# EAGLE design LPC1768 (EAGLE 7.5.0)

## Sheet 1 of 4
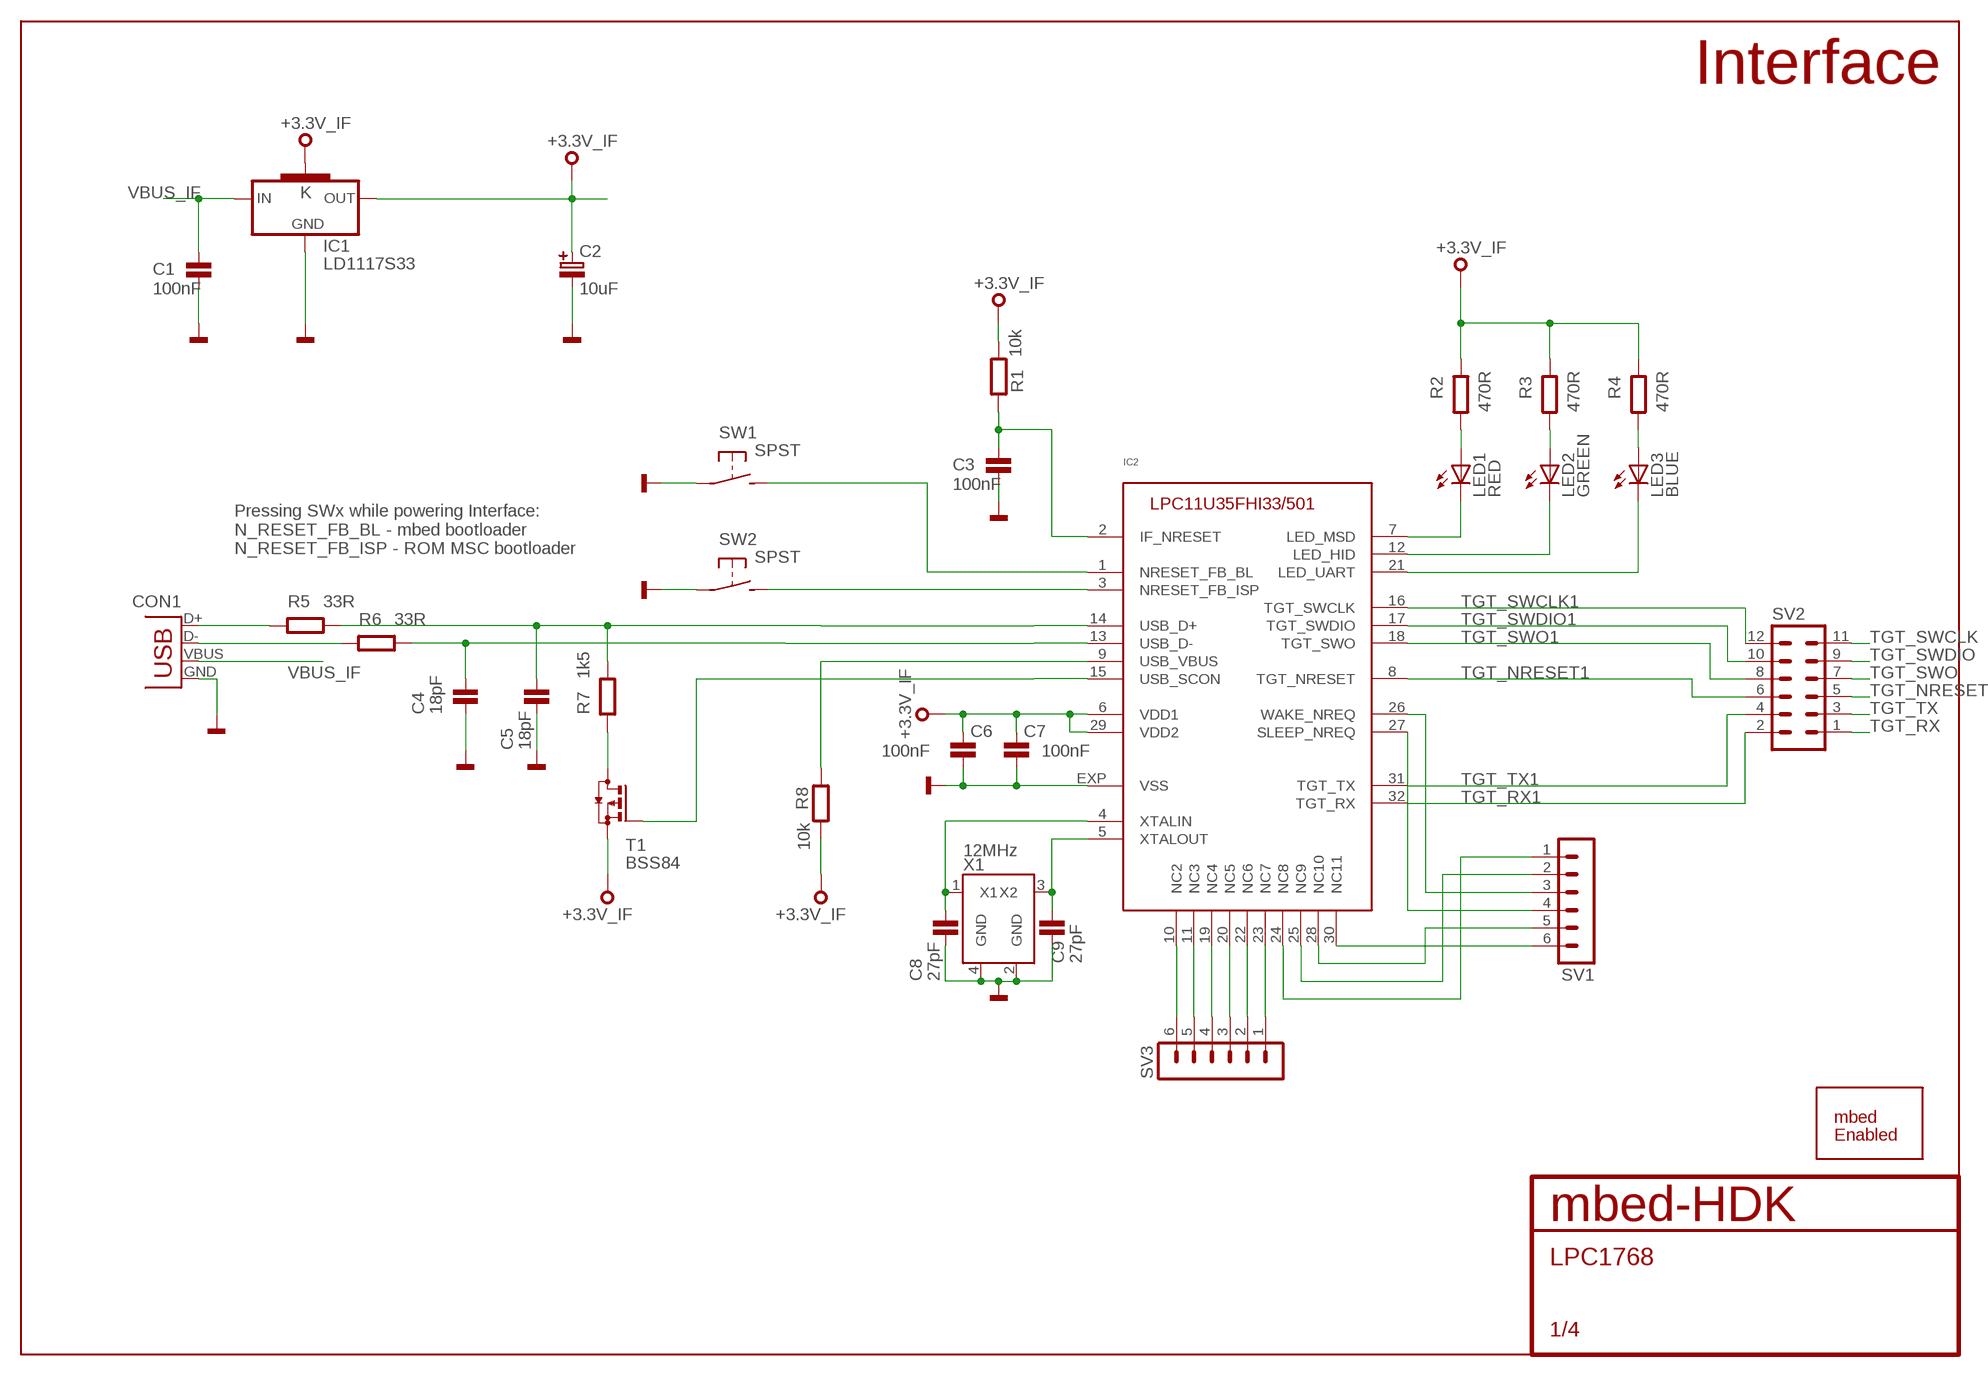
[diagram p0: schematic, sheet 1]

### Parts
C1  100nF  C0603  [0603]
C2  10uF  C-POLB  [CASE-B]
C3  100nF  C0603  [0603]
C4  18pF  C0603  [0603]
C5  18pF  C0603  [0603]
C6  100nF  C0603  [0603]
C7  100nF  C0603  [0603]
C8  27pF  C0603  [0603]
C9  27pF  C0603  [0603]
CON1  USB-MB-S  [USB-MB-S]
IC1  LD1117S33  [SOT223]
IC2  IF-LPC11U35  [HVQFN33]
LED1  RED  LED0603  [CHIPLED_0603]
LED2  GREEN  LED0603  [CHIPLED_0603]
LED3  BLUE  LED0603  [CHIPLED_0603]
R1  10k  R0603  [0603]
R2  470R  R0603  [0603]
R3  470R  R0603  [0603]
R4  470R  R0603  [0603]
R5  33R  R0603  [0603]
R6  33R  R0603  [0603]
R7  1k5  R0603  [0603]
R8  10k  R0603  [0603]
SS1  MBED-ENABLED-LOGOMEDIUM  [MBED-ENABLED-LOGO-500X500-MIL]
SV1  MA06-1  [MA06-1]
SV2  MA06-2  [MA06-2]
SV3  MA06-1  [MA06-1]
SW1  SPST  [DTSM-32S-B]
SW2  SPST  [DTSM-32S-B]
T1  BSS84  [SOT23]
X1  12MHz  ABM8  [OSC_CMD_32_25]

### Nets
+3.3V_IF: C2.1 C6.1 C7.1 IC1.2(OUT) IC1.4(K) IC2.6(VDD1) IC2.29(VDD2) R1.2 R2.1 R3.1 R4.1 R8.2 T1.2(S)
GND: C1.2 C2.2 C3.2 C4.2 C5.2 C6.2 C7.2 C8.2 C9.2 CON1.GND IC1.1(GND) IC2.EXP(VSS) SW1.P$1(P) SW2.P$1(P) X1.2(GND) X1.4(GND) ; also sheet 2,3
GREEN: IC2.12(LED_HID) LED2.C
GREEN1: IC2.7(LED_MSD) LED1.C
N$1: C5.1 IC2.14(USB_D+) R5.2 R7.2
N$2: C4.1 IC2.13(USB_D-) R6.2
N$3: CON1.D- R6.1
N$4: CON1.D+ R5.1
N$5: C3.1 IC2.2(IF_NRESET) R1.1
N$6: R7.1 T1.3(D)
N$7: IC2.9(USB_VBUS) R8.1
N$8: LED1.A R2.2
N$9: LED2.A R3.2
N$11: C8.1 IC2.4(XTALIN) X1.1(X1)
N$12: C9.1 IC2.5(XTALOUT) X1.3(X2)
N$13: IC2.21(LED_UART) LED3.C
N$15: IC2.1(NRESET_FB_BL) SW1.P$2(S)
N$17: IC2.3(NRESET_FB_ISP) SW2.P$2(S)
N$18: LED3.A R4.2
N$19: IC2.15(USB_SCON) T1.1(G)
N$79: IC2.30(NC11) SV1.6
N$80: IC2.28(NC10) SV1.5
N$81: IC2.27(SLEEP_NREQ) SV1.4
N$82: IC2.26(WAKE_NREQ) SV1.3
N$83: IC2.25(NC9) SV1.2
N$84: IC2.24(NC8) SV1.1
N$85: IC2.10(NC2) SV3.6
N$86: IC2.11(NC3) SV3.5
N$87: IC2.19(NC4) SV3.4
N$88: IC2.20(NC5) SV3.3
N$89: IC2.22(NC6) SV3.2
N$90: IC2.23(NC7) SV3.1
TGT_NRESET: SV2.5 ; also sheet 2
TGT_NRESET1: IC2.8(TGT_NRESET) SV2.6
TGT_RX: SV2.1 ; also sheet 2
TGT_RX1: IC2.32(TGT_RX) SV2.2
TGT_SWCLK: SV2.11 ; also sheet 2
TGT_SWCLK1: IC2.16(TGT_SWCLK) SV2.12
TGT_SWDIO: SV2.9 ; also sheet 2
TGT_SWDIO1: IC2.17(TGT_SWDIO) SV2.10
TGT_SWO: SV2.7 ; also sheet 2
TGT_SWO1: IC2.18(TGT_SWO) SV2.8
TGT_TX: SV2.3 ; also sheet 2
TGT_TX1: IC2.31(TGT_TX) SV2.4
VBUS_IF: C1.1 CON1.VBUS IC1.3(IN) ; also sheet 3

### Notes on the sheet
- Interface
- Pressing SWx while powering Interface:
  N_RESET_FB_BL - mbed bootloader
  N_RESET_FB_ISP - ROM MSC bootloader

## Sheet 2 of 4
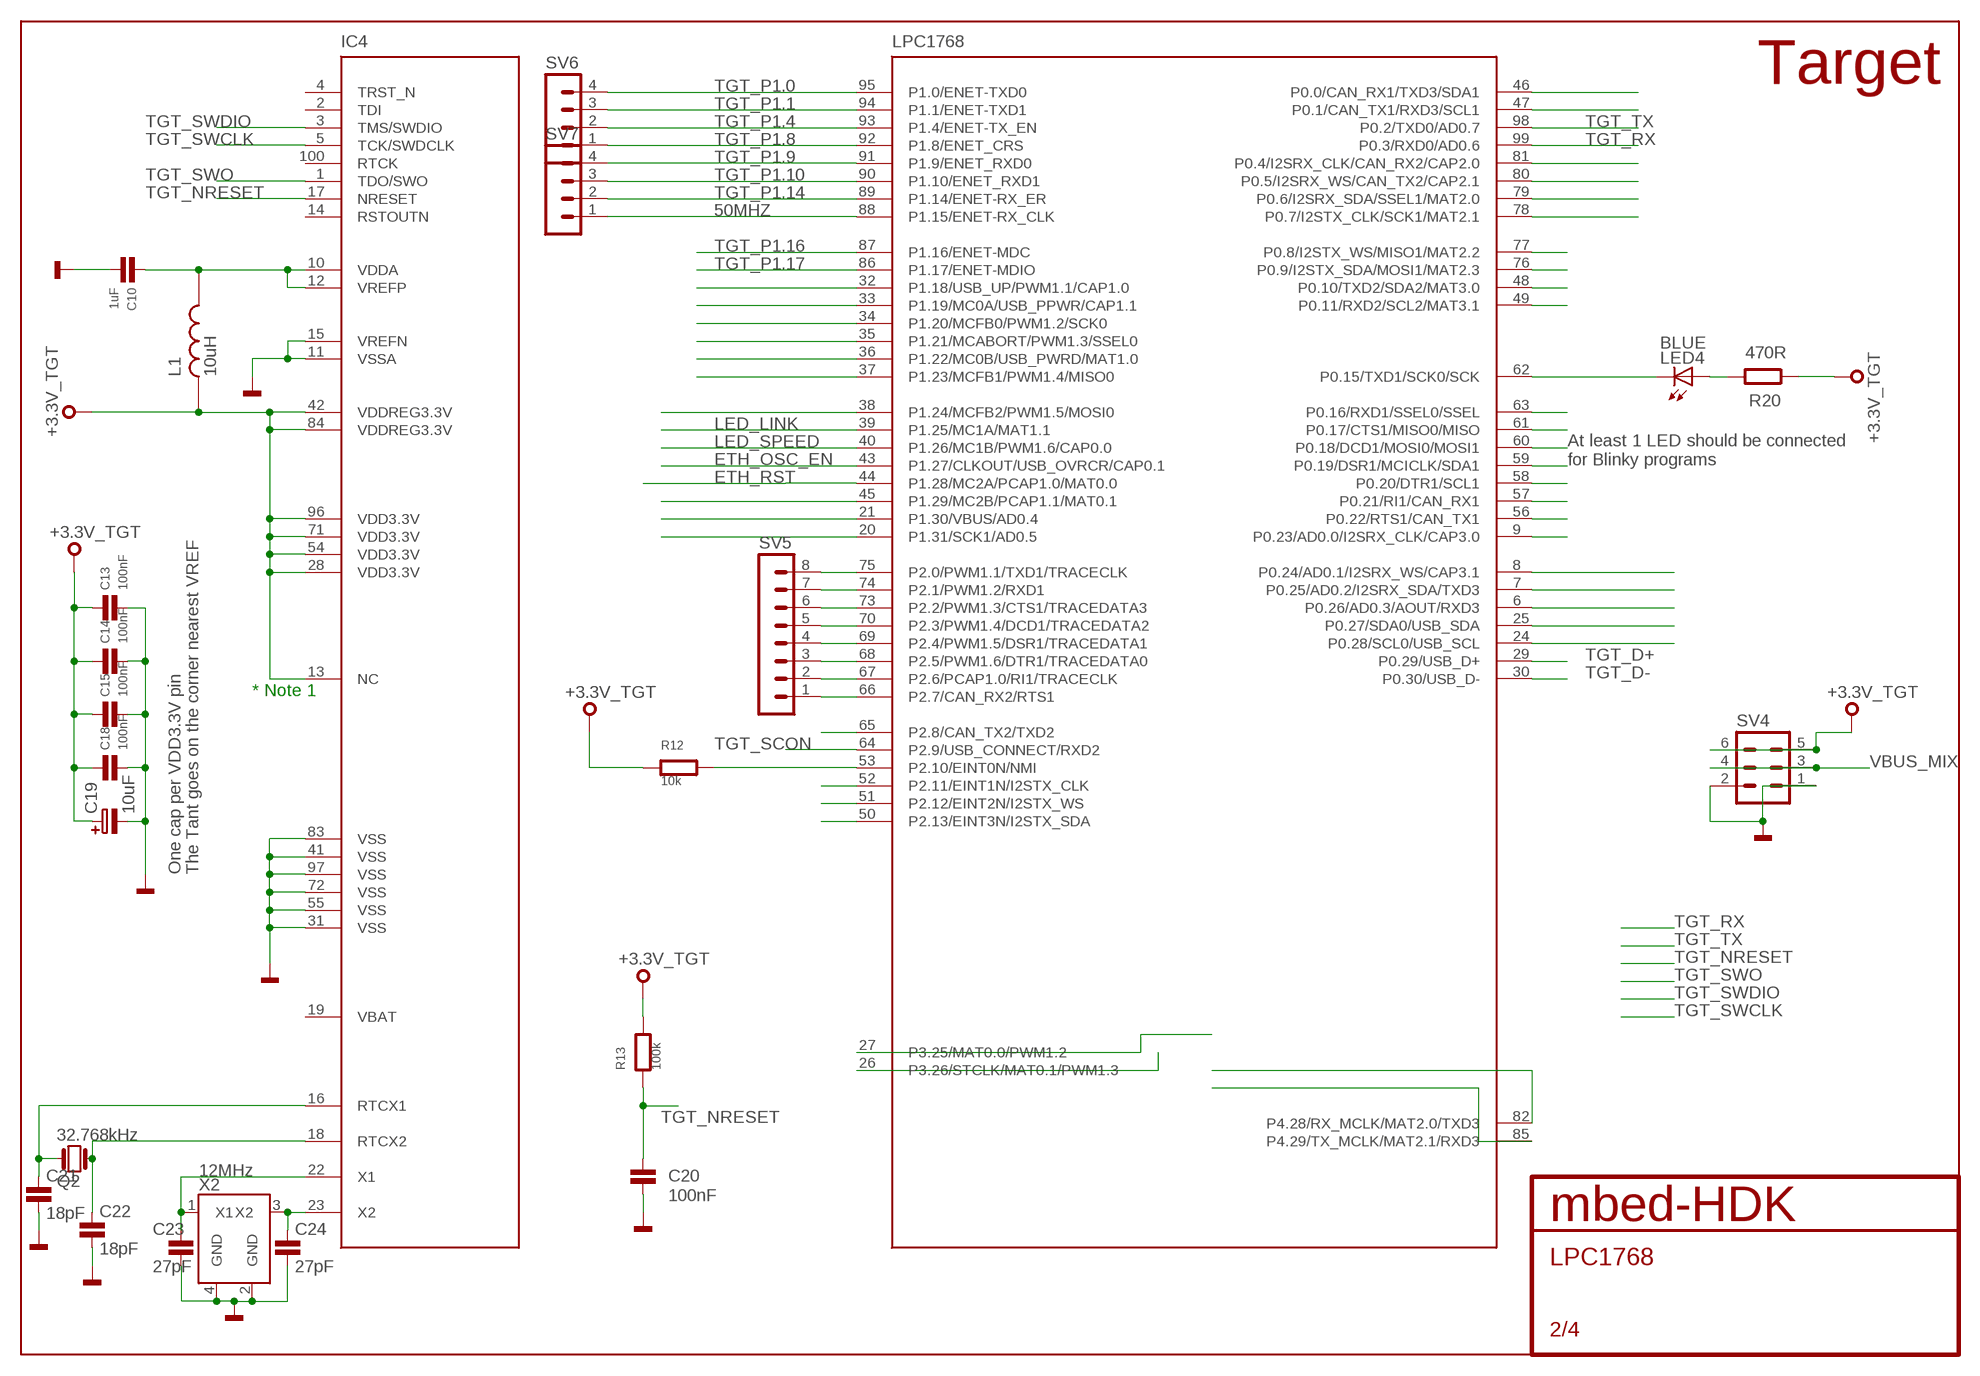
[diagram p1: schematic, sheet 2]

### Parts
C10  1uF  C0603  [0603]
C13  100nF  C0603  [0603]
C14  100nF  C0603  [0603]
C15  100nF  C0603  [0603]
C18  100nF  C0603  [0603]
C19  10uF  C-POLB  [CASE-B]
C20  100nF  C0603  [0603]
C21  18pF  C0603  [0603]
C22  18pF  C0603  [0603]
C23  27pF  C0603  [0603]
C24  27pF  C0603  [0603]
IC4  LPC1768  [LQFP100]
L1  10uH  L  [0603]
LED4  BLUE  LED0603  [CHIPLED_0603]
Q2  32.768kHz  Q_FC135  [FC135]
R12  10k  R0603  [0603]
R13  100k  R0603  [0603]
R20  470R  R0603  [0603]
SV4  MA03-2  [MA03-2]
SV5  MA08-1  [MA08-1]
SV6  MA04-1  [MA04-1]
SV7  MA04-1  [MA04-1]
X2  12MHz  ABM8  [OSC_CMD_32_25]

### Nets
50MHZ: IC4.88(P1.15/ENET-RX_CLK) SV7.1
+3.3V_TGT: C13.1 C14.1 C15.1 C18.1 C19.1 IC4.13(NC) IC4.28(VDD3.3V) IC4.42(VDDREG3.3V) IC4.54(VDD3.3V) IC4.71(VDD3.3V) IC4.84(VDDREG3.3V) IC4.96(VDD3.3V) L1.1 R12.1 R13.2 R20.1 SV4.5 SV4.6 ; also sheet 3
ETH_OSC_EN: IC4.43(P1.27/CLKOUT/USB_OVRCR/CAP0.1)
ETH_RST: IC4.44(P1.28/MC2A/PCAP1.0/MAT0.0)
GND: C10.2 C13.2 C14.2 C15.2 C18.2 C19.2 C20.1 C21.1 C22.1 C23.1 C24.1 IC4.11(VSSA) IC4.15(VREFN) IC4.31(VSS) IC4.41(VSS) IC4.55(VSS) IC4.72(VSS) IC4.83(VSS) IC4.97(VSS) SV4.1 SV4.2 X2.2(GND) X2.4(GND) ; also sheet 1,3
LED_LINK: IC4.39(P1.25/MC1A/MAT1.1)
LED_SPEED: IC4.40(P1.26/MC1B/PWM1.6/CAP0.0)
N$16: C10.1 IC4.10(VDDA) IC4.12(VREFP) L1.2
N$20: IC4.53(P2.10/EINT0N/NMI) R12.2
N$21: C23.2 IC4.22(X1) X2.1(X1)
N$23: C21.2 IC4.16(RTCX1) Q2.X2
N$24: C22.2 IC4.18(RTCX2) Q2.X1
N$25: IC4.62(P0.15/TXD1/SCK0/SCK) LED4.C
N$26: LED4.A R20.2
N$27: IC4.32(P1.18/USB_UP/PWM1.1/CAP1.0)
N$30: IC4.33(P1.19/MC0A/USB_PPWR/CAP1.1)
N$31: IC4.34(P1.20/MCFB0/PWM1.2/SCK0)
N$32: IC4.35(P1.21/MCABORT/PWM1.3/SSEL0)
N$33: IC4.36(P1.22/MC0B/USB_PWRD/MAT1.0)
N$34: IC4.37(P1.23/MCFB1/PWM1.4/MISO0)
N$35: IC4.38(P1.24/MCFB2/PWM1.5/MOSI0)
N$36: IC4.45(P1.29/MC2B/PCAP1.1/MAT0.1)
N$37: IC4.21(P1.30/VBUS/AD0.4)
N$38: IC4.20(P1.31/SCK1/AD0.5)
N$39: IC4.75(P2.0/PWM1.1/TXD1/TRACECLK) SV5.8
N$40: IC4.74(P2.1/PWM1.2/RXD1) SV5.7
N$41: IC4.73(P2.2/PWM1.3/CTS1/TRACEDATA3) SV5.6
N$42: IC4.70(P2.3/PWM1.4/DCD1/TRACEDATA2) SV5.5
N$43: IC4.69(P2.4/PWM1.5/DSR1/TRACEDATA1) SV5.4
N$44: IC4.68(P2.5/PWM1.6/DTR1/TRACEDATA0) SV5.3
N$45: IC4.67(P2.6/PCAP1.0/RI1/TRACECLK) SV5.2
N$46: IC4.66(P2.7/CAN_RX2/RTS1) SV5.1
N$47: IC4.65(P2.8/CAN_TX2/TXD2)
N$48: IC4.52(P2.11/EINT1N/I2STX_CLK)
N$49: IC4.51(P2.12/EINT2N/I2STX_WS)
N$50: IC4.50(P2.13/EINT3N/I2STX_SDA)
N$51: IC4.27(P3.25/MAT0.0/PWM1.2)
N$52: IC4.26(P3.26/STCLK/MAT0.1/PWM1.3)
N$53: IC4.82(P4.28/RX_MCLK/MAT2.0/TXD3)
N$54: IC4.85(P4.29/TX_MCLK/MAT2.1/RXD3)
N$55: IC4.24(P0.28/SCL0/USB_SCL)
N$56: IC4.25(P0.27/SDA0/USB_SDA)
N$57: IC4.6(P0.26/AD0.3/AOUT/RXD3)
N$58: IC4.7(P0.25/AD0.2/I2SRX_SDA/TXD3)
N$59: IC4.8(P0.24/AD0.1/I2SRX_WS/CAP3.1)
N$60: IC4.9(P0.23/AD0.0/I2SRX_CLK/CAP3.0)
N$61: IC4.56(P0.22/RTS1/CAN_TX1)
N$62: IC4.57(P0.21/RI1/CAN_RX1)
N$63: IC4.58(P0.20/DTR1/SCL1)
N$64: IC4.59(P0.19/DSR1/MCICLK/SDA1)
N$65: IC4.60(P0.18/DCD1/MOSI0/MOSI1)
N$66: IC4.61(P0.17/CTS1/MISO0/MISO)
N$67: IC4.63(P0.16/RXD1/SSEL0/SSEL)
N$68: IC4.49(P0.11/RXD2/SCL2/MAT3.1)
N$69: IC4.48(P0.10/TXD2/SDA2/MAT3.0)
N$70: IC4.76(P0.9/I2STX_SDA/MOSI1/MAT2.3)
N$71: IC4.77(P0.8/I2STX_WS/MISO1/MAT2.2)
N$72: IC4.78(P0.7/I2STX_CLK/SCK1/MAT2.1)
N$73: IC4.79(P0.6/I2SRX_SDA/SSEL1/MAT2.0)
N$74: IC4.80(P0.5/I2SRX_WS/CAN_TX2/CAP2.1)
N$75: IC4.81(P0.4/I2SRX_CLK/CAN_RX2/CAP2.0)
N$76: IC4.47(P0.1/CAN_TX1/RXD3/SCL1)
N$77: IC4.46(P0.0/CAN_RX1/TXD3/SDA1)
N$78: C24.2 IC4.23(X2) X2.3(X2)
TGT_D+: IC4.29(P0.29/USB_D+) ; also sheet 3
TGT_D-: IC4.30(P0.30/USB_D-) ; also sheet 3
TGT_NRESET: C20.2 IC4.17(NRESET) R13.1 ; also sheet 1
TGT_P1.0: IC4.95(P1.0/ENET-TXD0) SV6.4
TGT_P1.1: IC4.94(P1.1/ENET-TXD1) SV6.3
TGT_P1.4: IC4.93(P1.4/ENET-TX_EN) SV6.2
TGT_P1.8: IC4.92(P1.8/ENET_CRS) SV6.1
TGT_P1.9: IC4.91(P1.9/ENET_RXD0) SV7.4
TGT_P1.10: IC4.90(P1.10/ENET_RXD1) SV7.3
TGT_P1.14: IC4.89(P1.14/ENET-RX_ER) SV7.2
TGT_P1.16: IC4.87(P1.16/ENET-MDC)
TGT_P1.17: IC4.86(P1.17/ENET-MDIO)
TGT_RX: IC4.99(P0.3/RXD0/AD0.6) ; also sheet 1
TGT_SCON: IC4.64(P2.9/USB_CONNECT/RXD2) ; also sheet 3
TGT_SWCLK: IC4.5(TCK/SWDCLK) ; also sheet 1
TGT_SWDIO: IC4.3(TMS/SWDIO) ; also sheet 1
TGT_SWO: IC4.1(TDO/SWO) ; also sheet 1
TGT_TX: IC4.98(P0.2/TXD0/AD0.7) ; also sheet 1
VBUS_MIX: SV4.3 SV4.4 ; also sheet 3
Unconnected: IC4.2(TDI) IC4.4(TRST_N) IC4.14(RSTOUTN) IC4.19(VBAT) IC4.100(RTCK)

### Notes on the sheet
- Target
- At least 1 LED should be connected
  for Blinky programs
- * Note 1
- One cap per VDD3.3V pin | The Tant goes on the corner nearest VREF

## Sheet 3 of 4
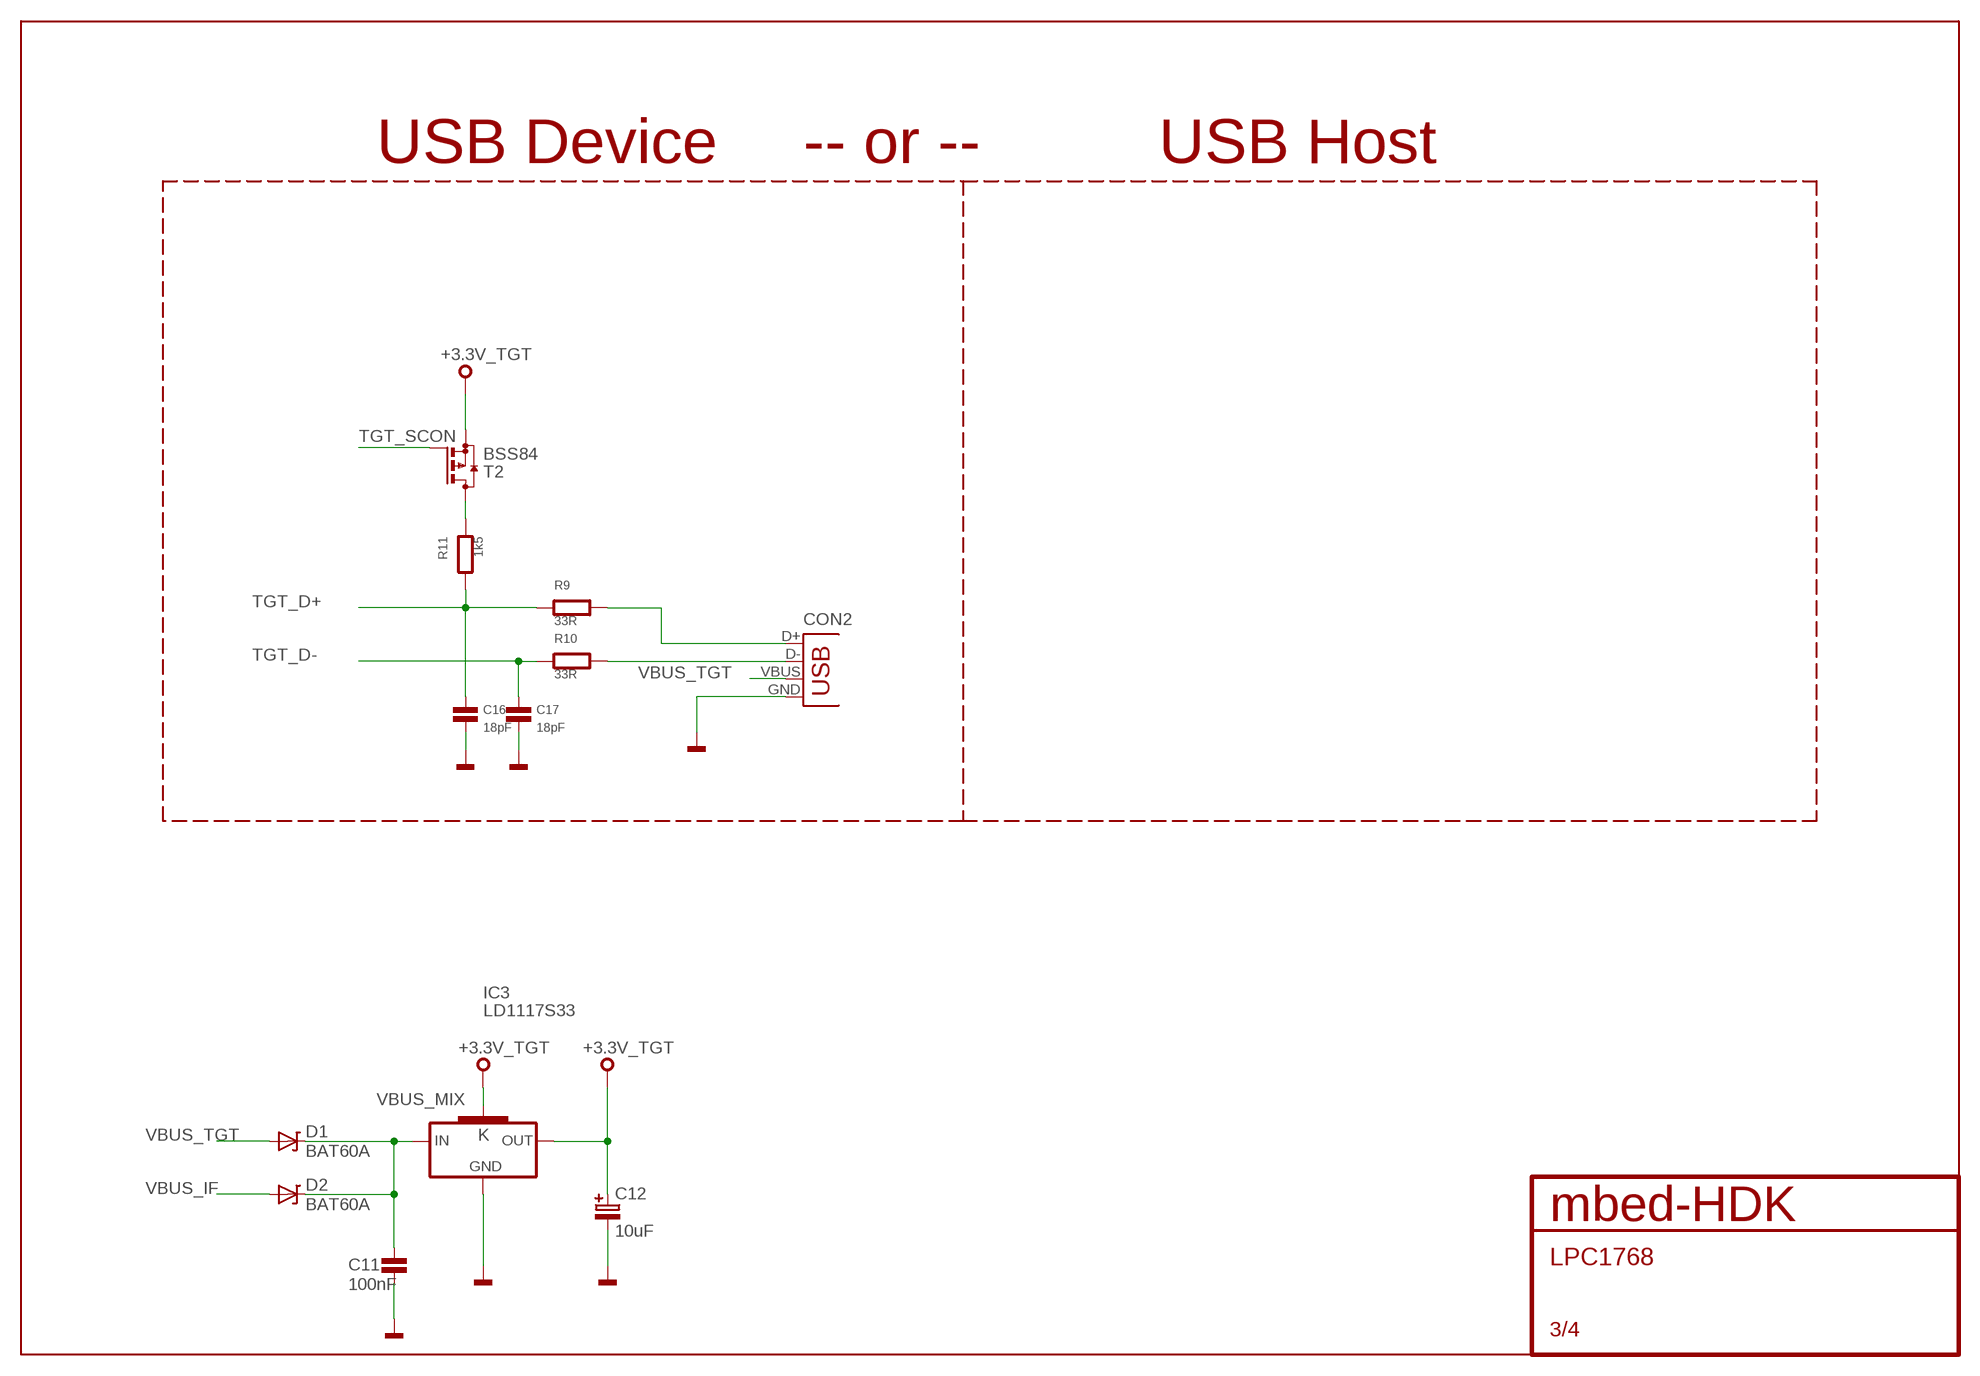
[diagram p2: schematic, sheet 3]

### Parts
C11  100nF  C0603  [0603]
C12  10uF  C-POLB  [CASE-B]
C16  18pF  C0603  [0603]
C17  18pF  C0603  [0603]
CON2  USB-MB-S  [USB-MB-S]
D1  BAT60A  [BAT60A]
D2  BAT60A  [BAT60A]
IC3  LD1117S33  [SOT223]
R9  33R  R0603  [0603]
R10  33R  R0603  [0603]
R11  1k5  R0603  [0603]
T2  BSS84  [SOT23]

### Nets
+3.3V_TGT: C12.1 IC3.2(OUT) IC3.4(K) T2.2(S) ; also sheet 2
GND: C11.2 C12.2 C16.2 C17.2 CON2.GND IC3.1(GND) ; also sheet 1,2
N$14: R11.1 T2.3(D)
N$28: CON2.D- R10.2
N$29: CON2.D+ R9.2
TGT_D+: C16.1 R9.1 R11.2 ; also sheet 2
TGT_D-: C17.1 R10.1 ; also sheet 2
TGT_SCON: T2.1(G) ; also sheet 2
VBUS_IF: D2.A ; also sheet 1
VBUS_MIX: C11.1 D1.K D2.K IC3.3(IN) ; also sheet 2
VBUS_TGT: CON2.VBUS D1.A

### Notes on the sheet
- USB Device | -- or -- | USB Host

## Sheet 4 of 4
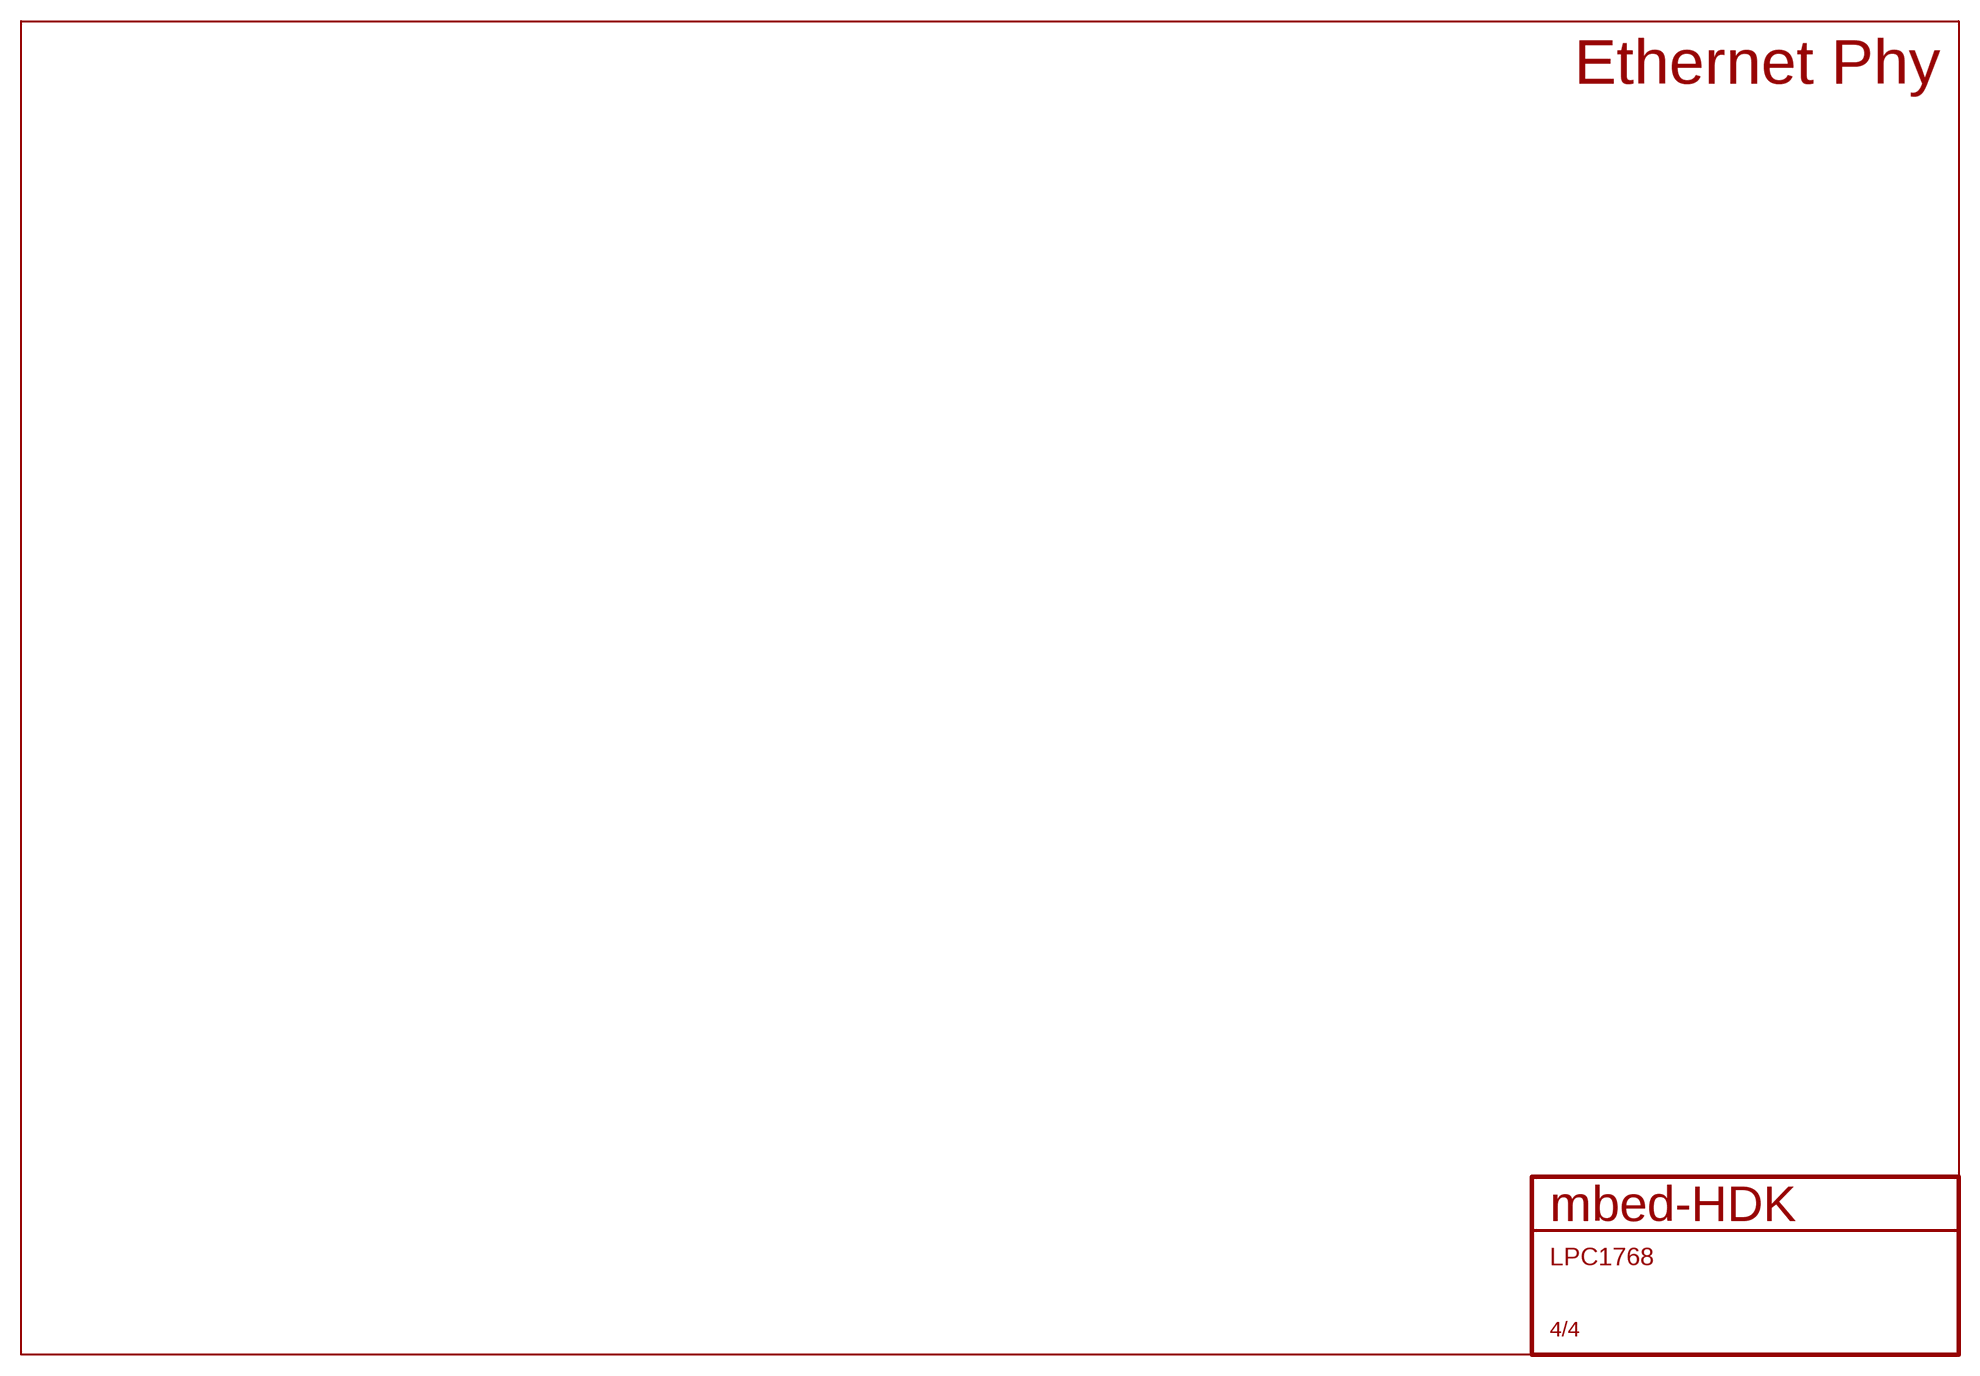
[diagram p3: schematic, sheet 4]

### Notes on the sheet
- Ethernet Phy

## Library data of the parts
C1 C3-C11 C13-C18 C20-C24 = mbed-HDK:C
C2 C12 C19 = mbed-HDK:C-POL
CON1 CON2 = mbed-HDK:USB: USB Connectors
D1 D2 = mbed-HDK:BAT60A
IC1 IC3 = mbed-HDK:LD1117S33: VOLTAGE REGULATOR SMD 3,3V
IC2 = mbed-HDK:IF-LPC11U35
IC4 = mbed-HDK:LPC1768
L1 = mbed-HDK:L
LED1-LED4 = mbed-HDK:LED
Q2 = mbed-HDK:Q
R1-R13 R20 = mbed-HDK:R
SS1 = mbed-HDK:MBED-ENABLED-LOGO
SV1 SV3 = con-lstb:MA06-1: PIN HEADER; OC_FARNELL: unknown; OC_NEWARK: unknown
SV2 = con-lstb:MA06-2: PIN HEADER; OC_FARNELL: unknown; OC_NEWARK: unknown
SV4 = con-lstb:MA03-2: PIN HEADER; OC_FARNELL: unknown; OC_NEWARK: unknown
SV5 = con-lstb:MA08-1: PIN HEADER; OC_FARNELL: unknown; OC_NEWARK: unknown
SV6 SV7 = con-lstb:MA04-1: PIN HEADER; OC_FARNELL: unknown; OC_NEWARK: unknown
SW1 SW2 = mbed-HDK:SPST
T1 T2 = mbed-HDK:BSS84: P-CHANNEL MOS FET
X1 X2 = crystals_oscillators:ABM8

## Net classes
0 default: width 0.152 mm, drill 0.305 mm, clearance 0.152 mm

## Board
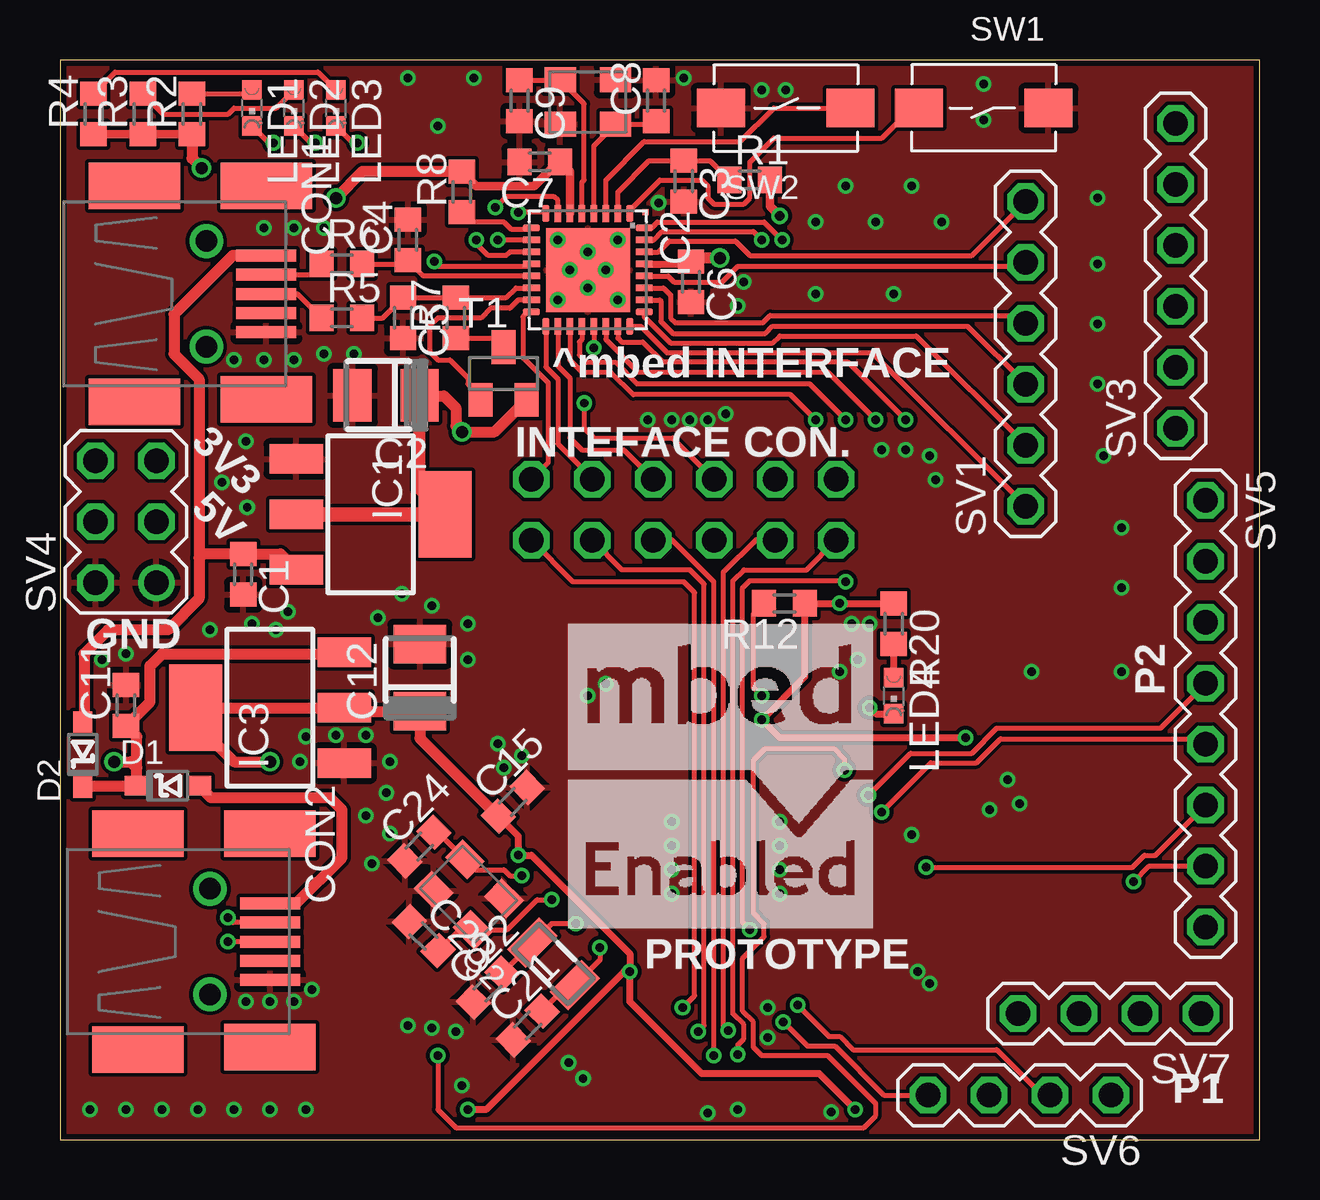
[diagram p4: board, top side]
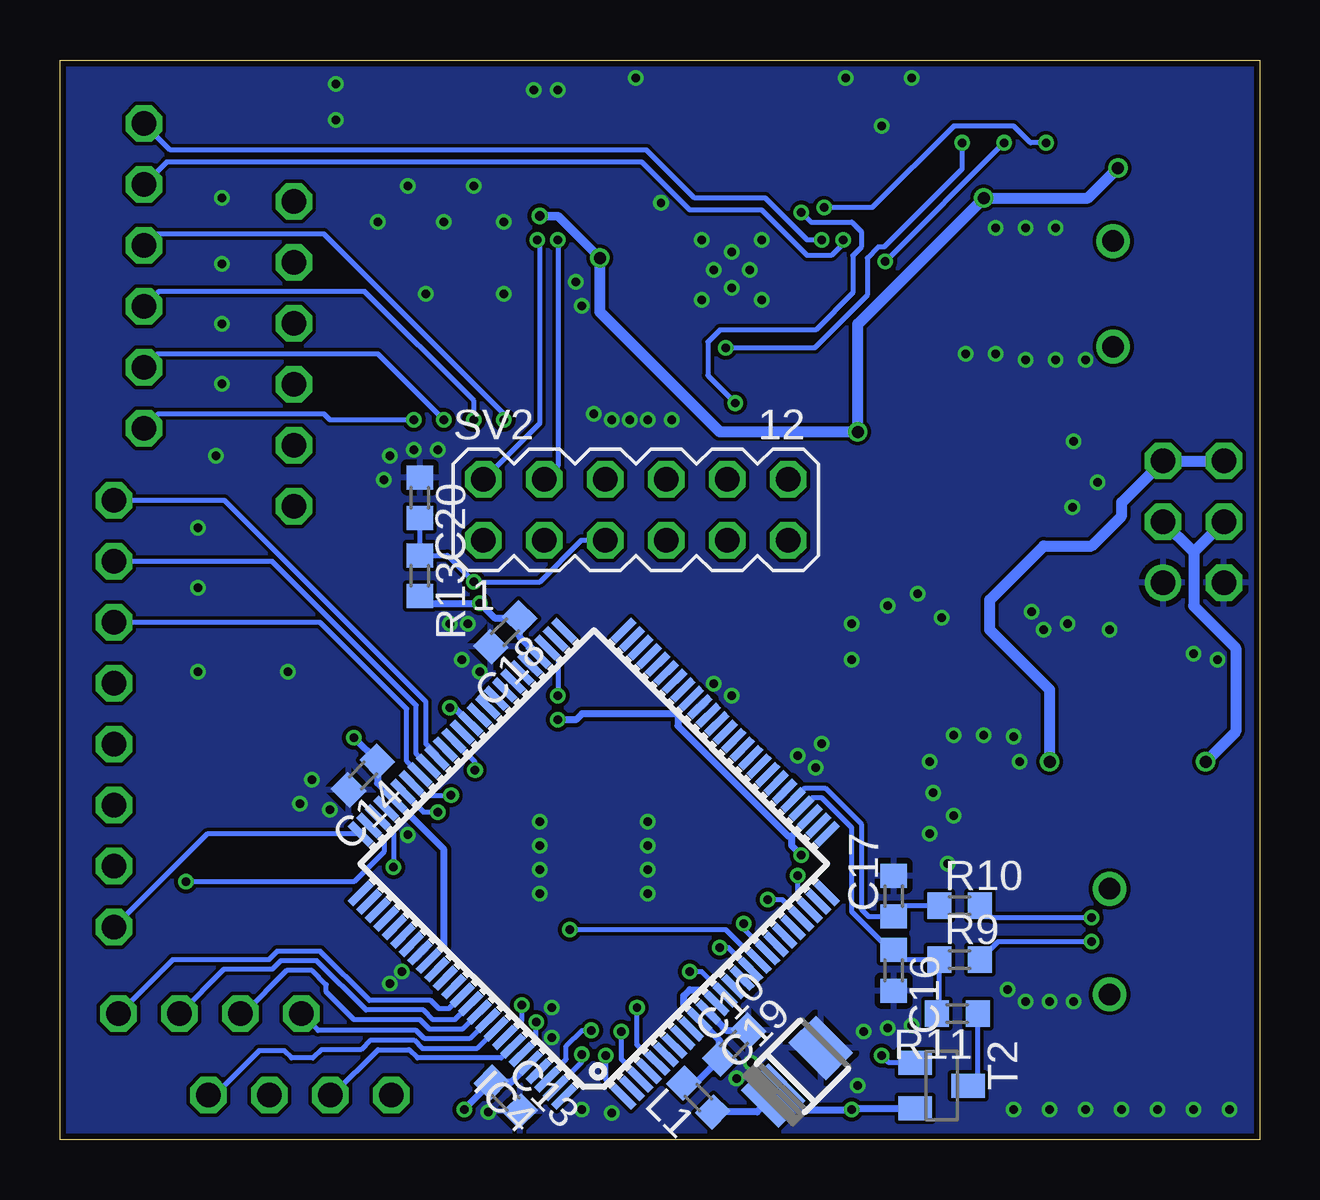
[diagram p5: board, bottom side, seen from below]

Size 50 x 45 mm. Coordinates in mm from the lower left corner, seen from the top.
Outline: 0,0 50,0 50,45 0,45 0,0
Copper layers (1*16): Top 0.035mm / dielectric 1.5mm / Bottom 0.035mm
Design rules "itead": minimum track width 6mil, minimum drill 12mil, track to track 6mil, track to pad 6mil, pad to pad 6mil, via to via 6mil, smd to smd 0mil, copper to edge 10mil, drill to drill 10mil, minimum pad ring 10mil, minimum via ring 6mil, stop-mask expansion 2mil, vias tented up to drill 100mil, thermal gap 10mil

### Footprints (pad centres in the part's own frame; a part is rotated, then mirrored left to right if it is on the bottom)
0603 = smd 1 x 1.1: 1 -0.85,0; 2 0.85,0
CASE-B = smd 1.6 x 2.2: 1 -1.4,0; 2 1.4,0
USB-MB-S = smd 2.5 x 0.5: D+ 2.5,0; D- 2.5,0.8; GND 2.5,-1.6; ID 2.5,-0.8; VBUS 2.5,1.6 | smd 3.81 x 1.93: GND@1 -3,4.5; GND@2 2.5,4.5; GND@3 -3,-4.5; GND@4 2.5,-4.4 | drill 0.9: P$5 0,2.2; P$6 0,-2.2
BAT60A = smd 1 x 0.8: A 1.3,0; K -1.3,0
SOT223 = smd 1.219 x 2.235: 1 -2.311,-3.099; 2 0,-3.099; 3 2.311,-3.099 | smd 3.6 x 2.2: 4 0,3.099
HVQFN33 = smd 0.7 x 0.28: 1 -2.35,1.75; 2 -2.35,1.25; 3 -2.35,0.75; 4 -2.35,0.25; 5 -2.35,-0.25; 6 -2.35,-0.75; 7 -2.35,-1.25; 8 -2.35,-1.75; 17 2.35,-1.75; 18 2.35,-1.25; 19 2.35,-0.75; 20 2.35,-0.25; 21 2.35,0.25; 22 2.35,0.75; 23 2.35,1.25; 24 2.35,1.75 | smd 0.28 x 0.7: 9 -1.75,-2.35; 10 -1.25,-2.35; 11 -0.75,-2.35; 12 -0.25,-2.35; 13 0.25,-2.35; 14 0.75,-2.35; 15 1.25,-2.35; 16 1.75,-2.35; 25 1.75,2.35; 26 1.25,2.35; 27 0.75,2.35; 28 0.25,2.35; 29 -0.25,2.35; 30 -0.75,2.35; 31 -1.25,2.35; 32 -1.75,2.35 | smd 3.5 x 3.5: EXP 0,0 | smd 0.25 x 0.25: M1 -2.415,2.415
LQFP100 = smd 1.2 x 0.32: 1 -7.75,6; 2 -7.75,5.5; 3 -7.75,5; 4 -7.75,4.5; 5 -7.75,4; 6 -7.75,3.5; 7 -7.75,3; 8 -7.75,2.5; 9 -7.75,2; 10 -7.75,1.5; 11 -7.75,1; 12 -7.75,0.5; 13 -7.75,0; 14 -7.75,-0.5; 15 -7.75,-1; 16 -7.75,-1.5; 17 -7.75,-2; 18 -7.75,-2.5; 19 -7.75,-3; 20 -7.75,-3.5; 21 -7.75,-4; 22 -7.75,-4.5; 23 -7.75,-5; 24 -7.75,-5.5; 25 -7.75,-6; 51 7.75,-6; 52 7.75,-5.5; 53 7.75,-5; 54 7.75,-4.5; 55 7.75,-4; 56 7.75,-3.5; 57 7.75,-3; 58 7.75,-2.5; 59 7.75,-2; 60 7.75,-1.5; 61 7.75,-1; 62 7.75,-0.5; 63 7.75,0; 64 7.75,0.5; 65 7.75,1; 66 7.75,1.5; 67 7.75,2; 68 7.75,2.5; 69 7.75,3; 70 7.75,3.5; 71 7.75,4; 72 7.75,4.5; 73 7.75,5; 74 7.75,5.5; 75 7.75,6 | smd 0.32 x 1.2: 26 -6,-7.75; 27 -5.5,-7.75; 28 -5,-7.75; 29 -4.5,-7.75; 30 -4,-7.75; 31 -3.5,-7.75; 32 -3,-7.75; 33 -2.5,-7.75; 34 -2,-7.75; 35 -1.5,-7.75; 36 -1,-7.75; 37 -0.5,-7.75; 38 0,-7.75; 39 0.5,-7.75; 40 1,-7.75; 41 1.5,-7.75; 42 2,-7.75; 43 2.5,-7.75; 44 3,-7.75; 45 3.5,-7.75; 46 4,-7.75; 47 4.5,-7.75; 48 5,-7.75; 49 5.5,-7.75; 50 6,-7.75; 76 6,7.75; 77 5.5,7.75; 78 5,7.75; 79 4.5,7.75; 80 4,7.75; 81 3.5,7.75; 82 3,7.75; 83 2.5,7.75; 84 2,7.75; 85 1.5,7.75; 86 1,7.75; 87 0.5,7.75; 88 0,7.75; 89 -0.5,7.75; 90 -1,7.75; 91 -1.5,7.75; 92 -2,7.75; 93 -2.5,7.75; 94 -3,7.75; 95 -3.5,7.75; 96 -4,7.75; 97 -4.5,7.75; 98 -5,7.75; 99 -5.5,7.75; 100 -6,7.75
CHIPLED_0603 = smd 0.8 x 0.8: A 0,-0.75; C 0,0.75
FC135 = smd 1.1 x 1.9: X1 -1.25,0; X2 1.25,0
MA06-1 = drill 1.016 octagon: 1 -6.35,0; 2 -3.81,0; 3 -1.27,0; 4 1.27,0; 5 3.81,0; 6 6.35,0
MA06-2 = drill 1.016 octagon: 1 -6.35,-1.27; 2 -6.35,1.27; 3 -3.81,-1.27; 4 -3.81,1.27; 5 -1.27,-1.27; 6 -1.27,1.27; 7 1.27,-1.27; 8 1.27,1.27; 9 3.81,-1.27; 10 3.81,1.27; 11 6.35,-1.27; 12 6.35,1.27
MA03-2 = drill 1.016: 1 -2.54,-1.27 | drill 1.016 octagon: 2 -2.54,1.27; 3 0,-1.27; 4 0,1.27; 5 2.54,-1.27; 6 2.54,1.27
MA08-1 = drill 1.016 octagon: 1 -8.89,0; 2 -6.35,0; 3 -3.81,0; 4 -1.27,0; 5 1.27,0; 6 3.81,0; 7 6.35,0; 8 8.89,0
MA04-1 = drill 1.016 octagon: 1 -3.81,0; 2 -1.27,0; 3 1.27,0; 4 3.81,0
DTSM-32S-B = smd 2 x 1.6: P$1 -2.7,0; P$2 2.7,0
SOT23 = smd 1 x 1.4: 1 -0.95,-1.1; 2 0.95,-1.1; 3 0,1.1
OSC_CMD_32_25 = smd 1.3 x 1.05: 1 -1.15,0.925; 2 1.15,0.925; 3 1.15,-0.925; 4 -1.15,-0.925

### Placement (x,y rotation side)
C1  7.64,23.56 270 top
C2  13.59,31.02 180 top
C3  26,39.95 270 top
C4  14.5,37.5 90 top
C5  14.3,34.25 270 top
C6  26.3,35.75 270 top
C7  20,40.75 180 top
C8  24.85,43.3 90 top
C9  19.15,43.3 270 top
C10  21.9,3.95 45 bottom
C11  2.75,18.1 90 top
C12  15,19.25 90 top
C13  31.42,1.78 315 bottom
C14  37.37,15.18 225 bottom
C15  18.88,14.08 45 top
C16  15.25,7.05 270 bottom
C17  15.25,10.15 90 bottom
C18  31.44,21.14 225 bottom
C19  19.27,2.83 45 bottom
C20  35,26.75 270 bottom
C21  19.5,4.76 45 top
C22  17.82,6.33 45 top
C23  15.16,8.48 315 top
C24  14.98,12.21 45 top
CON1  6.1,35.25 0 top
CON2  6.25,8.25 0 top
D1  4.5,14.75 0 top
D2  0.95,16.05 90 top
IC1  12.95,26.06 270 top
IC2  22,36.25 270 top
IC3  8.75,18 90 top
IC4  27.75,11.5 135 bottom
L1  23.4,1.75 135 bottom
LED1  8,43 180 top
LED2  9.75,43 180 top
LED3  11.5,43 180 top
LED4  34.75,18.5 180 top
Q2  20.57,7.32 315 top
R1  28.75,40 0 top
R2  5.5,42.75 90 top
R3  3.45,42.75 90 top
R4  1.4,42.75 90 top
R5  11.75,34.25 0 top
R6  11.75,36.5 0 top
R7  16.5,34.25 90 top
R8  16.75,39.5 90 top
R9  12.5,7.5 0 bottom
R10  12.5,9.75 0 bottom
R11  12.6,5.25 180 bottom
R12  30.2,22.35 180 top
R13  35,23.5 270 bottom
R20  34.75,21.5 270 top
SS1  21.2,8.82 0 top
SV1  40.25,32.75 90 top
SV2  26,26.25 0 bottom
SV3  46.5,36 90 top
SV4  2.75,25.75 90 top
SV5  47.75,17.75 270 top
SV6  40,1.85 180 top
SV7  43.75,5.25 180 top
SW1  38.5,43 180 top
SW2  30.25,43 0 top
T1  18.49,31.93 0 top
T2  13.25,2.25 270 bottom
X1  22,43.25 180 top
X2  17.04,10.21 135 top

### Tracks (layer width: path | path; a pad name or v marks a point on that pad's centre or on a via)
50MHZ
  Bottom 0.2: IC4.88 33.8,5.45 34.2,5.45 34.55,5.8 37.1,5.8 39.15,7.85 40.95,7.85 41.3,7.5 45.31,7.5 SV7.1
+3.3V_IF  (via drill 0.4, 0.5)
  Top 0.3: IC2.29 26.15,36.5 C6.1
  Top 0.35: IC2.6 21.25,40.35 C7.1 20.75,40.75 19.75,39.75 17.35,39.75 R8.2 | R2.1 R3.1 R4.1 | v30,38.5 29.6,38.9 R1.2
  Top 0.45: 15.01,31 16,31 16.5,30.5 16.5,29.75 v16.75,29.5 18.11,29.5 T1.2 | R8.2 12.6,40.35 v11.5,39.25 | R2.1 5.5,40.9 v5.9,40.5 | v27.5,36.75 26.4,36.75 C6.1
  Top 0.5: IC1.4 14.99,27.12 C2.1
  Top 0.6: IC1.4 IC1.2 | 14.85,30.88 C2.1 15.01,31 | 19.44,30.44 T1.2
  Bottom 0.35: v27.5,36.75 29.25,38.5 v30,38.5
  Bottom 0.45: v5.9,40.5 7.15,39.25 v11.5,39.25 16.75,34 v16.75,29.5 22.5,29.5 27.5,34.5 v27.5,36.75
+3.3V_TGT  (via drill 0.35, 0.5)
  Top 0.3: R20.1 v32.5,22.35 R12.1 31.05,19.3 v29.25,17.5 30,16.75 v37.75,16.75 | v17,1.25 17.75,1.25 23.5,7 v23.75,7 | v33.15,1.25 31.65,2.75 26.75,2.75 23.75,5.75 v23.75,7 | C15.1 19.1,12.65 v19.1,11.85 19.65,11.85 23.75,7.75 v23.75,7
  Top 0.45: v8.75,15.75 7.25,15.75 5.65,17.35 IC3.4 IC3.2 12,17.85 C12.1 15,16.73 18.25,13.48 C15.1
  Bottom 0.2: IC4.13 23.25,7 v23.75,7
  Bottom 0.3: v19.1,11.85 19.5,12.25 19.5,12.65 | 19.5,12.65 18.73,13.42 IC4.28 | IC4.42 24.25,17.83 | 24.25,17.83 24.25,17.25 19.65,12.65 19.5,12.65 | 24.25,17.83 24.33,17.75 28.25,17.75 28.5,17.5 v29.25,17.5 | IC4.54 30.84,20.96 C18.1 31.89,21.74 v32.5,22.35 34.7,22.35 R13.2 | v37.75,16.75 v37.74,16.75 C14.1 36.77,14.86 IC4.71 34,12.09 34,8.08 IC4.84 | T2.2 16.95,1.3 v17,1.25 19.68,1.25 C19.1 20.95,1.15 L1.1 | v33.15,1.25 v33.15,1.26 C13.1 31.21,2.38 IC4.96
  Bottom 0.45: v8.75,15.75 8.75,18.75 11.25,21.25 11.25,22.5 9,24.75 7,24.75 5.75,26 5.75,26.56 SV4.5 SV4.6
GND  (via drill 0.35)
  Bottom 0.3: IC4.11 22.21,4.55 C10.2
  other vias: 22,37 20.75,37.5 21.25,36.25 20.75,35 22,35.5 23.25,35 22.75,36.25 23.25,37.5 24.95,39.05 28.25,34.75 28.5,35.75 31.5,35.25 34.75,35.25 31.5,38.25 32.75,39.75 34,38.25 35.5,39.75 36.75,38.25 11,38 9.75,38 8.5,38 8.5,32.5 9.75,32.5 11,32.75 7.75,29.1 6.75,27.4 7.8,26.35 29.25,43.75 30.25,43.75 26,44.25 17.25,44.25 15.75,42.25 14.5,44.25 38.5,44 38.5,42.5 9.5,22 6.25,21.25 8,21.5 15.5,22.25 14.25,22.75 13.25,21.75 2.75,20.25 1.75,20 1.25,1.25 2.75,1.25 4.25,1.25 5.75,1.25 7.25,1.25 8.75,1.25 10.25,1.25 14.5,4.75 15.5,4.65 16.5,4.5 16.75,2.25 33,21.5 33.25,20 33.75,21.5 36.5,27.5 36.25,28.5 35.25,28.75 34.25,28.75 24.5,30 25.5,30 26.25,30 27,30 27.75,30.25 9,21.25 7.75,5.75 8.75,5.75 9.75,5.75 10.5,6.25 7.25,32.5 40,14 39.5,15 38.75,13.75 35.5,12.7 35.75,7 36.25,6.5 27,1.1 28.25,1.25 32.15,1.15 17,21.5 17,20 18.5,15.5 19.25,16 18.25,16.5 22.75,19 22,18.5 32.5,19.5 29.5,4.25 29.5,5.5 10,15.75 10.25,16.8 11.5,16.85 12.75,16.85 13.6,14.45 13.75,15.75 13.75,12.75 13,11.5 12.75,13.5 12.25,32.75 30,13.25 30,12.25 30,11.25 30,10.25 25.5,13.25 25.5,12.25 25.5,11.25 25.5,10.25 21.8,2.55 21.2,3.2 43.25,39.25 43.25,36.5 43.25,34 43.25,31.5 43.5,28.5 44.25,25.5 44.25,23 44.25,19.5 40.5,19.5
  pour Bottom: 0,45 50,45 50,0 0,0
  pour Top: 0,45 50,45 50,0 0,0
GREEN  (via drill 0.35)
  Top 0.2: 9.85,42.25 LED2.C 10.45,41.55 v10.65,41.55 | v15.6,36.6 15.8,36.4 19.55,36.4 IC2.12
  Bottom 0.2: v15.6,36.6 v10.65,41.55
GREEN1  (via drill 0.35)
  Top 0.2: IC2.7 20.75,39.15 20.6,39.3 18.6,39.3 v18.15,38.85 | 8.1,42.25 LED1.C 8.7,41.55 v8.9,41.55
  Bottom 0.2: v8.9,41.55 9.55,41.55 10.25,42.25 12.75,42.25 16.15,38.85 v18.15,38.85
N$1
  Top 0.2: 14.4,35 C5.1 | C5.1 R7.2 18.6,35.1 19,35.5 IC2.14 | R5.2 13.45,34.25 C5.1
N$2
  Top 0.2: IC2.13 15.15,36 C4.1 14.35,36.5 R6.2
N$3
  Top 0.2: CON1.D- 10.45,36.05 R6.1
N$4
  Top 0.2: CON1.D+ 9.9,35.25 R5.1
N$5
  Top 0.2: IC2.2 23.25,39.5 24.55,40.8 C3.1 27.1,40.8 R1.1
N$6
  Top 0.2: R7.1 18.12,33.4 T1.3
N$7
  Top 0.2: R8.1 17.15,38.25 18.5,38.25 18.8,37.95 19.6,37.95 IC2.9
N$8
  Top 0.2: R2.2 7.85,43.6 LED1.A
N$9
  Top 0.2: 3.65,43.6 R3.2 4.3,42.75 7,42.75 7.25,43 9,43 LED2.A
N$11
  Top 0.2: IC2.4 22.25,41.42 X1.1 24.73,42.33 C8.1
N$12
  Top 0.2: IC2.5 21.75,39.9 21.85,40 21.85,43.17 X1.3 20.82,44.15 C9.1
N$13  (via drill 0.35)
  Top 0.2: IC2.21 v22.25,33 | 11.6,42.25 LED3.C 12.2,41.55 v12.4,41.55
  Bottom 0.2: v12.4,41.55 12.4,40.45 15.65,37.2 15.9,37.2 16.35,36.75 16.35,35.2 18.55,33 v22.25,33
N$14
  Bottom 0.2: T2.3 11.75,2.65 R11.1
N$15
  Top 0.2: IC2.1 23.75,38.75 25,40 26.75,40 27,39.75 27,39.25 27.25,39 28.5,39 28.75,39.25 28.75,40.75 29.75,41.75 34.25,41.75 35.5,43 SW1.P$2
N$16
  Bottom 0.3: IC4.12 23.21,6.25 23.75,6.25 24,6 24,5.63 IC4.10 22.5,4.13 C10.1 23.5,2.35 L1.2
N$17
  Top 0.2: IC2.3 22.75,40 24.35,41.6 28.35,41.6 29.75,43 SW2.P$2 32.11,43
N$18
  Top 0.2: 1.6,43.6 R4.2 2.3,44.5 10.75,44.5 LED3.A
N$19
  Top 0.2: IC2.15 19.1,35 18.75,34.65 17.95,34.65 17.55,34.25 15.75,34.25 15.4,33.9 15.4,32.85 15.75,32.5 16.25,32.5 17,31.75 17,31.5 17.54,30.96 T1.1
N$20  (via drill 0.35)
  Top 0.2: v29.25,18.5 28.9,18.85 28.9,21.9 R12.2
  Bottom 0.2: IC4.53 29.25,20.07 v29.25,18.5
N$21  (via drill 0.35)
  Top 0.2: v20.5,10 19.89,10 18.63,8.75 X2.1 16.62,8.75 C23.2
  Bottom 0.2: IC4.22 19.89,10 v20.5,10
N$23  (via drill 0.35)
  Top 0.2: v22.5,8 22.5,7.48 Q2.X2 21.18,6.44 C21.2
  Bottom 0.2: IC4.16 22.13,8 v22.5,8
N$24  (via drill 0.35)
  Top 0.2: v21.5,9 20.48,9 Q2.X1 19.69,8.2 C22.2
  Bottom 0.2: IC4.18 21.5,8.79 v21.5,9
N$25  (via drill 0.35)
  Top 0.3: v33.75,18 34,17.75 LED4.C
  Bottom 0.3: IC4.62 33.54,18 v33.75,18
N$26
  Top 0.3: LED4.A R20.2
N$28  (via drill 0.35)
  Top 0.2: CON2.D- 7.2,9.05 v7,9.25
  Bottom 0.2: v7,9.25 11.15,9.25 R10.2
N$29  (via drill 0.35)
  Top 0.2: CON2.D+ v7,8.25
  Bottom 0.2: v7,8.25 10.9,8.25 R9.2
N$39
  Bottom 0.2: IC4.75 43.87,12.74 SV5.8
N$40  (via drill 0.35)
  Top 0.2: v44.75,10.75 45.4,11.4 SV5.7
  Bottom 0.2: IC4.74 36.5,12.47 36.5,12 37.75,10.75 v44.75,10.75
N$41  (via drill 0.35)
  Top 0.2: v36.1,11.35 44.7,11.35 45.2,11.85 45.66,11.85 SV5.6
  Bottom 0.2: IC4.73 36.1,12.78 v36.1,11.35
N$42  (via drill 0.35)
  Top 0.2: v34.25,13.65 36.3,15.7 38.2,15.7 39.2,16.7 47.53,16.7 SV5.5
  Bottom 0.2: IC4.70 34.85,13.65 v34.25,13.65
N$43  (via drill 0.35)
  Top 0.2: v33.7,14.35 35.45,16.1 38,16.1 39.05,17.15 45.88,17.15 SV5.4
  Bottom 0.2: IC4.69 34.84,14.35 v33.7,14.35
N$44
  Bottom 0.2: IC4.68 35.55,15.76 35.55,17.95 39.16,21.56 SV5.3
N$45
  Bottom 0.2: IC4.67 35.15,16.07 35.15,18.1 41.15,24.1 SV5.2
N$46
  Bottom 0.2: IC4.66 34.29,16.04 34.75,16.5 34.75,18.25 43.14,26.64 SV5.1
N$78  (via drill 0.35)
  Top 0.2: v19.25,11 18.75,11 18.5,11.25 17.31,11.25 X2.3 15.74,12.82 C24.2
  Bottom 0.2: IC4.23 19.25,10.07 v19.25,11
N$79
  Top 0.2: IC2.30 24.95,37 25.4,37.45 28.15,37.45 28.75,36.85 38,36.85 SV1.6
N$80
  Top 0.2: IC2.28 25.35,36 25.6,35.75 27.6,35.75 28.25,36.4 40.09,36.4 SV1.5
N$81
  Top 0.2: IC2.27 25.15,35.5 25.45,35.2 25.45,34.25 25.65,34.05 29.3,34.05 29.6,34.35 39.92,34.35 SV1.4 40.02,34.25
N$82
  Top 0.2: IC2.26 25,35 25.05,34.95 25.05,34.1 25.55,33.6 29.4,33.6 29.7,33.9 37.83,33.9 SV1.3
N$83
  Top 0.2: IC2.25 24.35,34.3 25.45,33.2 29.7,33.2 30,33.5 35.69,33.5 SV1.2
N$84
  Top 0.2: IC2.24 24.2,33.9 25.3,32.8 33.85,32.8 SV1.1
N$85  (via drill 0.35)
  Top 0.2: IC2.10 v18.25,37.5
  Bottom 0.2: v18.25,37.5 18.85,37.5 20.6,39.25 23.55,39.25 25.55,41.25 45.4,41.25 SV3.6
N$86  (via drill 0.35)
  Top 0.2: IC2.11 18.75,37 18.6,36.85 17.85,36.85 17.35,37.35 v17.35,37.5
  Bottom 0.2: v17.35,37.5 17.35,37.35 17.85,36.85 18.85,36.85 20.75,38.75 23.75,38.75 25.75,40.75 45.56,40.75 SV3.5
N$87  (via drill 0.35)
  Top 0.2: IC2.19 21.25,32.5 21.75,32 22.95,32 23.9,31.05 30.45,31.05 v31.5,30
  Bottom 0.2: SV3.4 46.02,37.75 39,37.75 31.5,30.25 v31.5,30
N$88  (via drill 0.35)
  Top 0.2: IC2.20 21.75,33.35 21.65,33.25 21.65,32.7 21.95,32.4 23.15,32.4 24.05,31.5 31.25,31.5 v32.75,30
  Bottom 0.2: SV3.3 45.88,35.35 37.3,35.35 32.75,30.8 v32.75,30
N$89  (via drill 0.35)
  Top 0.2: IC2.22 22.75,33.35 24.1,32 32,32 v34,30
  Bottom 0.2: v34,30 36.75,32.75 45.94,32.75 SV3.2
N$90  (via drill 0.35)
  Top 0.2: IC2.23 23.25,33.4 23.4,33.25 24.3,33.25 25.15,32.4 32.85,32.4 v35.25,30
  Bottom 0.2: v35.25,30 38.75,30 39,30.25 45.9,30.25 SV3.1
TGT_D+
  Bottom 0.2: IC4.29 18.64,14.25 18.25,14.25 17,13 17,9.5 15.4,7.9 C16.1 14.85,7.5 R9.1 13.35,5.35 R11.2
TGT_D-
  Bottom 0.2: R10.1 14.8,9.75 C17.1 16.3,9.3 16.6,9.6 16.6,13.15 18.1,14.65 18.94,14.65 IC4.30
TGT_NRESET  (via drill 0.35)
  Top 0.2: v28.75,8.75 28.45,9.05 28.45,23 28.75,23.3 32.7,23.3 v32.75,23.25
  Bottom 0.2: IC4.17 20.93,7.43 22.25,8.75 v28.75,8.75 | C20.2 R13.1 33.85,24.35 v32.75,23.25 30,23.25 28.27,24.98 SV2.5
TGT_NRESET1  (via drill 0.35)
  Top 0.2: IC2.8 20.2,38.65 v19.1,38.65 | SV2.6 25.54,29.25 22.25,29.25 21.85,29.65 v21.85,30.7
  Bottom 0.2: v19.1,38.65 18.7,38.25 17,38.25 16.6,37.85 16.6,37.2 16.95,36.85 16.95,35.3 18.5,33.75 22.5,33.75 23,33.25 23,31.85 v21.85,30.7
TGT_P1.0  (via drill 0.35)
  Top 0.2: v30.15,4.9 31.15,3.9 32.3,3.9 34.35,1.85 SV6.4
  Bottom 0.2: IC4.95 30.15,4.15 v30.15,4.9
TGT_P1.1
  Bottom 0.2: IC4.94 31.61,3.4 35.1,3.4 35.45,3.75 36.75,3.75 38.65,1.85 SV6.3
TGT_P1.4  (via drill 0.35)
  Top 0.2: v30.75,5.6 32.05,4.3 32.5,4.3 33.05,3.75 39.05,3.75 40.95,1.85 SV6.2
  Bottom 0.2: IC4.93 30.75,4.96 v30.75,5.6
TGT_P1.8
  Bottom 0.2: IC4.92 32.62,3.8 34.9,3.8 35.25,4.15 37.05,4.15 37.45,3.75 39.1,3.75 39.45,3.4 40.35,3.4 40.65,3.7 41.7,3.7 43.55,1.85 SV6.1
TGT_P1.9
  Bottom 0.2: IC4.91 32.93,4.2 34.8,4.2 35.15,4.55 39.24,4.55 SV7.4
TGT_P1.10
  Bottom 0.2: IC4.90 33.24,4.6 34.6,4.6 35,5 37.75,5 38.9,6.15 38.9,6.45 39.5,7.05 40.55,7.05 42.35,5.25 SV7.3
TGT_P1.14
  Bottom 0.2: IC4.89 33.54,5 34.45,5 34.85,5.4 37.25,5.4 39.3,7.45 40.8,7.45 41.15,7.1 43.17,7.1 SV7.2
TGT_RX  (via drill 0.35)
  Top 0.2: v28.25,3.55 28.25,3.95 28.5,4.2 28.5,4.8 28.05,5.25 28.05,23.3 28.5,23.75 31.12,23.75 SV2.1
  Bottom 0.2: IC4.99 29.34,2.16 28.25,3.25 v28.25,3.55
TGT_RX1  (via drill 0.35)
  Top 0.2: IC2.32 24.65,38 24.9,38.25 29.35,38.25 v30.1,37.5
  Bottom 0.2: SV2.2 30,29.87 30,37.4 v30.1,37.5
TGT_SCON  (via drill 0.35)
  Top 0.2: v15.75,3.5 15.75,1.25 16.5,0.5 33.5,0.5 34,1 34,1.5 32,3.5 29.25,3.5 28.9,3.85 28.9,4.9 28.45,5.35 28.45,7.55 29.35,8.45 29.35,9 28.9,9.45 28.9,15.8 29.4,16.3 32.25,16.3 32.7,15.85 v32.7,15.4
  Bottom 0.2: T2.1 15.45,3.2 v15.75,3.5 | v32.7,15.4 32.7,15.74 IC4.64
TGT_SWCLK  (via drill 0.35)
  Top 0.2: v25.95,5.5 26.45,6 26.45,22.8 26,23.25 21.38,23.25 SV2.11
  Bottom 0.2: IC4.5 25.19,3.19 25.95,3.95 v25.95,5.5
TGT_SWCLK1
  Top 0.2: IC2.16 19.5,34.5 19.3,34.3 19.3,32.6 20.35,31.55 20.35,28.22 SV2.12
TGT_SWDIO  (via drill 0.35)
  Top 0.2: v26.6,4.5 26.85,4.75 26.85,23.15 26.25,23.75 23.42,23.75 SV2.9
  Bottom 0.2: IC4.3 25.8,2.56 26.6,3.35 v26.6,4.5
TGT_SWDIO1
  Top 0.2: IC2.17 20.25,32.2 20.75,31.7 20.75,29 22.19,27.56 SV2.10
TGT_SWO  (via drill 0.35)
  Top 0.2: v27.25,3.5 27.25,23.25 25.5,25 24.75,25 SV2.7
  Bottom 0.2: IC4.1 26.53,1.78 27.25,2.5 v27.25,3.5
TGT_SWO1
  Top 0.2: IC2.18 20.75,32.25 21.25,31.75 21.25,29.25 21.75,28.75 23.5,28.75 SV2.8
TGT_TX  (via drill 0.35)
  Top 0.2: v27.85,4.55 27.65,4.75 27.65,23.65 29,25 29.79,25 SV2.3
  Bottom 0.2: IC4.98 29.7,2.56 28.9,3.35 28.9,3.9 28.25,4.55 v27.85,4.55
TGT_TX1  (via drill 0.35)
  Top 0.2: IC2.31 24.75,37.5 25.1,37.85 28.9,37.85 v29.25,37.5
  Bottom 0.2: v29.25,37.5 29.25,28.08 SV2.4
VBUS_IF
  Top 0.45: CON1.VBUS 7.2,36.85 4.75,34.4 4.75,32.75 5.8,31.7 5.8,24.25 | 5.8,24.25 5.8,22.55 4.5,21.25 2,21.25 1,20.25 1,17.4 D2.A | IC1.3 9.19,24.41 C1.1 5.96,24.41 5.8,24.25
VBUS_MIX  (via drill 0.5)
  Top 0.45: D2.K D1.K 3.2,15.5 | 3.2,15.5 3.2,16.8 C11.1 3.75,18.25 3.75,19.75 4.25,20.25 11.79,20.25 IC3.3 | v2.25,15.75 2.95,15.75 3.2,15.5
  Bottom 0.45: SV4.4 2.75,24.48 | 2.75,24.48 SV4.3 | 2.75,24.48 2.75,22.25 1,20.5 1,17 v2.25,15.75
VBUS_TGT
  Top 0.45: CON2.VBUS 9.85,9.85 11.75,11.75 11.75,13.75 11.25,14.25 6.3,14.25 D1.A

### Text on the board
tPlace: ^mbed INTERFACE | 3V3 | INTEFACE CON. | 5V | P2 | GND | PROTOTYPE | P1